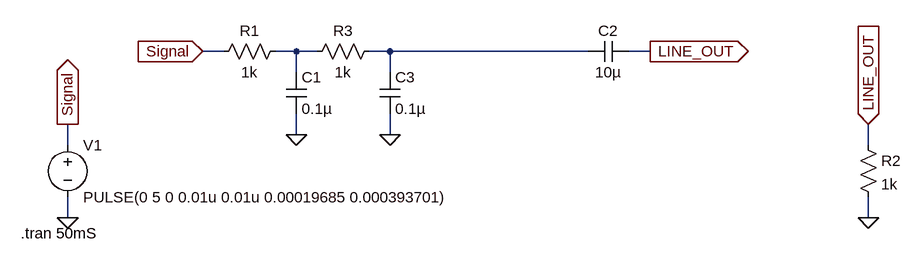
[diagram p0: schematic line-out_simulation_2.asc]
line-out_simulation_2.asc, the LTspice schematic file:
Version 4
SHEET 1 1320 680
WIRE 256 -32 224 -32
WIRE 368 -32 336 -32
WIRE 400 -32 368 -32
WIRE 512 -32 480 -32
WIRE 816 -32 512 -32
WIRE 912 -32 880 -32
WIRE 368 0 368 -32
WIRE 512 0 512 -32
WIRE 368 96 368 64
WIRE 512 96 512 64
WIRE 16 112 16 80
WIRE 1248 112 1248 80
WIRE 16 224 16 192
WIRE 1248 224 1248 192
FLAG 16 224 0
FLAG 16 80 Signal
IOPIN 16 80 Out
FLAG 368 96 0
FLAG 912 -32 LINE_OUT
IOPIN 912 -32 Out
FLAG 224 -32 Signal
IOPIN 224 -32 In
FLAG 1248 224 0
FLAG 1248 80 LINE_OUT
IOPIN 1248 80 In
FLAG 512 96 0
SYMBOL voltage 16 96 R0
WINDOW 123 0 0 Left 0
WINDOW 39 0 0 Left 0
SYMATTR InstName V1
SYMATTR Value PULSE(0 5 0 0.01u 0.01u 0.00019685 0.000393701)
SYMBOL res 352 -48 R90
WINDOW 0 0 56 VBottom 2
WINDOW 3 32 56 VTop 2
SYMATTR InstName R1
SYMATTR Value 1k
SYMBOL cap 352 0 R0
SYMATTR InstName C1
SYMATTR Value 0.1µ
SYMBOL cap 880 -48 R90
WINDOW 0 0 32 VBottom 2
WINDOW 3 32 32 VTop 2
SYMATTR InstName C2
SYMATTR Value 10µ
SYMBOL res 1232 96 R0
SYMATTR InstName R2
SYMATTR Value 1k
SYMBOL res 496 -48 R90
WINDOW 0 0 56 VBottom 2
WINDOW 3 32 56 VTop 2
SYMATTR InstName R3
SYMATTR Value 1k
SYMBOL cap 496 0 R0
SYMATTR InstName C3
SYMATTR Value 0.1µ
TEXT -56 248 Left 2 !.tran 50mS

The netlist it stands for:
* line-out_simulation_2.asc
V1 Signal 0 PULSE(0 5 0 0.01u 0.01u 0.00019685 0.000393701)
R1 N001 Signal 1k
C1 N001 0 0.1µ
C2 LINE_OUT N002 10µ
R2 LINE_OUT 0 1k
R3 N002 N001 1k
C3 N002 0 0.1µ
.tran 50mS
.backanno
.end